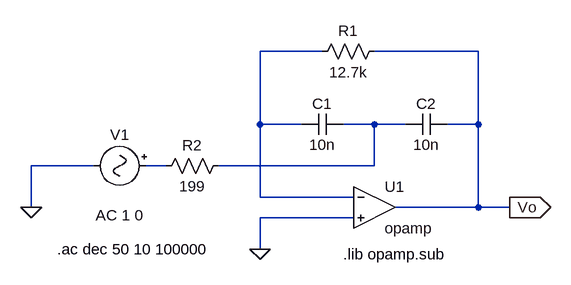
[diagram p0: schematic BookP2.asc]
BookP2.asc, the LTspice schematic file:
Version 4.1
SHEET 1 880 680
WIRE 144 -64 48 -64
WIRE 384 -64 224 -64
WIRE 48 48 48 -64
WIRE 112 48 48 48
WIRE 224 48 176 48
WIRE 272 48 224 48
WIRE 384 48 384 -64
WIRE 384 48 336 48
WIRE -208 112 -304 112
WIRE -96 112 -128 112
WIRE 224 112 224 48
WIRE 224 112 -16 112
WIRE 48 160 48 48
WIRE 192 160 48 160
WIRE -304 176 -304 112
WIRE 384 176 384 48
WIRE 384 176 256 176
WIRE 432 176 384 176
WIRE 192 192 48 192
WIRE 48 240 48 192
FLAG -304 176 0
FLAG 48 240 0
FLAG 432 176 Vo
IOPIN 432 176 Out
SYMBOL OpAmps\\opamp 224 112 R0
SYMATTR InstName U1
SYMBOL cap 176 32 R90
WINDOW 0 0 32 VBottom 2
WINDOW 3 32 32 VTop 2
SYMATTR InstName C1
SYMATTR Value 10n
SYMBOL cap 336 32 R90
WINDOW 0 0 32 VBottom 2
WINDOW 3 32 32 VTop 2
SYMATTR InstName C2
SYMATTR Value 10n
SYMBOL res 240 -80 R90
WINDOW 0 0 56 VBottom 2
WINDOW 3 32 56 VTop 2
SYMATTR InstName R1
SYMATTR Value 12.7k
SYMBOL res 0 96 R90
WINDOW 0 0 56 VBottom 2
WINDOW 3 32 56 VTop 2
SYMATTR InstName R2
SYMATTR Value 199
SYMBOL Misc\\signal -112 112 R90
WINDOW 0 -32 56 VBottom 2
WINDOW 3 32 56 VTop 2
WINDOW 123 60 56 VTop 2
WINDOW 39 0 0 Left 0
SYMATTR InstName V1
SYMATTR Value ""
SYMATTR Value2 AC 1 0
TEXT 176 248 Left 2 !.lib opamp.sub
TEXT -264 240 Left 2 !.ac dec 50 10 100000

The netlist it stands for:
* BookP2.asc
X§U1 N001 0 Vo opamp Aol=100K GBW=10Meg  ; pins invin noninvin out
C1 N002 N001 10n
C2 Vo N002 10n
R1 Vo N001 12.7k
R2 N002 N003 199
V1 N003 0 AC 1 0
.lib opamp.sub
.ac dec 50 10 100000
.backanno
.end